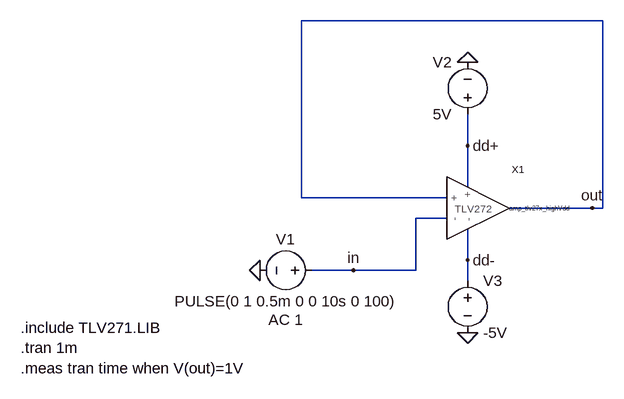
[diagram p0: schematic Exercise5.asc]
Exercise5.asc, the LTspice schematic file:
Version 4.1
SHEET 1 880 680
WIRE 512 -208 48 -208
WIRE 304 -16 304 -64
WIRE 304 48 304 -16
WIRE 48 64 48 -208
WIRE 272 64 48 64
WIRE 496 80 368 80
WIRE 512 80 512 -208
WIRE 512 80 496 80
WIRE 272 96 224 96
WIRE 304 160 304 112
WIRE 128 176 64 176
WIRE 224 176 224 96
WIRE 224 176 128 176
WIRE 304 192 304 160
FLAG -16 176 0
FLAG 128 176 in
FLAG 496 80 out
FLAG 304 -144 0
FLAG 304 -16 dd+
FLAG 304 160 dd-
FLAG 304 272 0
SYMBOL voltage 80 176 R90
WINDOW 0 -32 56 VBottom 2
WINDOW 3 32 56 VTop 2
WINDOW 123 60 56 VTop 2
WINDOW 39 0 0 Left 0
SYMATTR InstName V1
SYMATTR Value PULSE(0 1 0.5m 0 0 10s 0 100)
SYMATTR Value2 AC 1
SYMBOL voltage 304 -48 R180
WINDOW 0 24 96 Left 2
WINDOW 3 24 16 Left 2
WINDOW 123 0 0 Left 0
WINDOW 39 0 0 Left 0
SYMATTR InstName V2
SYMATTR Value 5V
SYMBOL voltage 304 176 R0
WINDOW 123 0 0 Left 0
WINDOW 39 0 0 Left 0
SYMATTR InstName V3
SYMATTR Value -5V
SYMBOL amp_tlv27x_highVdd 368 80 R0
WINDOW 3 0 0 Left 0
SYMATTR Value amp_tlv27x_highVdd
SYMATTR InstName X1
SYMATTR Prefix X
TEXT -384 264 Left 2 !.include TLV271.LIB\n.tran 1m\n.meas tran time when V(out)=1V

The netlist it stands for:
* Exercise5.asc
V1 in 0 PULSE(0 1 0.5m 0 0 10s 0 100) AC 1
V2 dd+ 0 5V
V3 dd- 0 -5V
X§X1 in out dd+ dd- out amp_tlv27x_highVdd params: amp_tlv27x_highVdd  ; pins 1 2 3 4 5
.include TLV271.LIB
.tran 1m
.meas tran time when V(out)=1V
.backanno
.end

* Results of the author's LTspice run, read from the files saved beside the schematic
* Operating Point, zero values left out:
*   V(dd+) = 5 V
*   V(dd-) = -5 V
*   V(out) = -280.4 µV
*   I(V1) = 6.9 pA
*   I(V2) = -67.78 µA
*   I(V3) = 67.78 µA
*   Ix(x1:1) = -6.9 pA
*   Ix(x1:2) = -6.901 pA
*   Ix(x1:3) = 67.78 µA
*   Ix(x1:4) = -67.78 µA
*   Ix(x1:5) = 7.131 pA
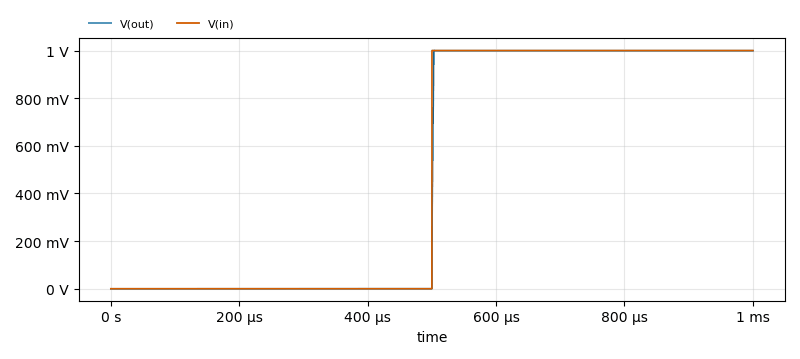
[diagram p1: Transient Analysis of Exercise5.asc, plotted from the saved traces]
* Transient Analysis, 1 run:
*   V(out): min -280.4 µV, max 1.001 V, average 498.4 mV, rms 705.5 mV, last 999.4 mV
*   V(in): min 0 V, max 1 V, average 500 mV, rms 707.1 mV, last 1 V
* From the log:
*   time: V(out)=1V AT 0.000503502719411